# EAGLE schematic switch-QPC1022_v2 (EAGLE 9.5.1)
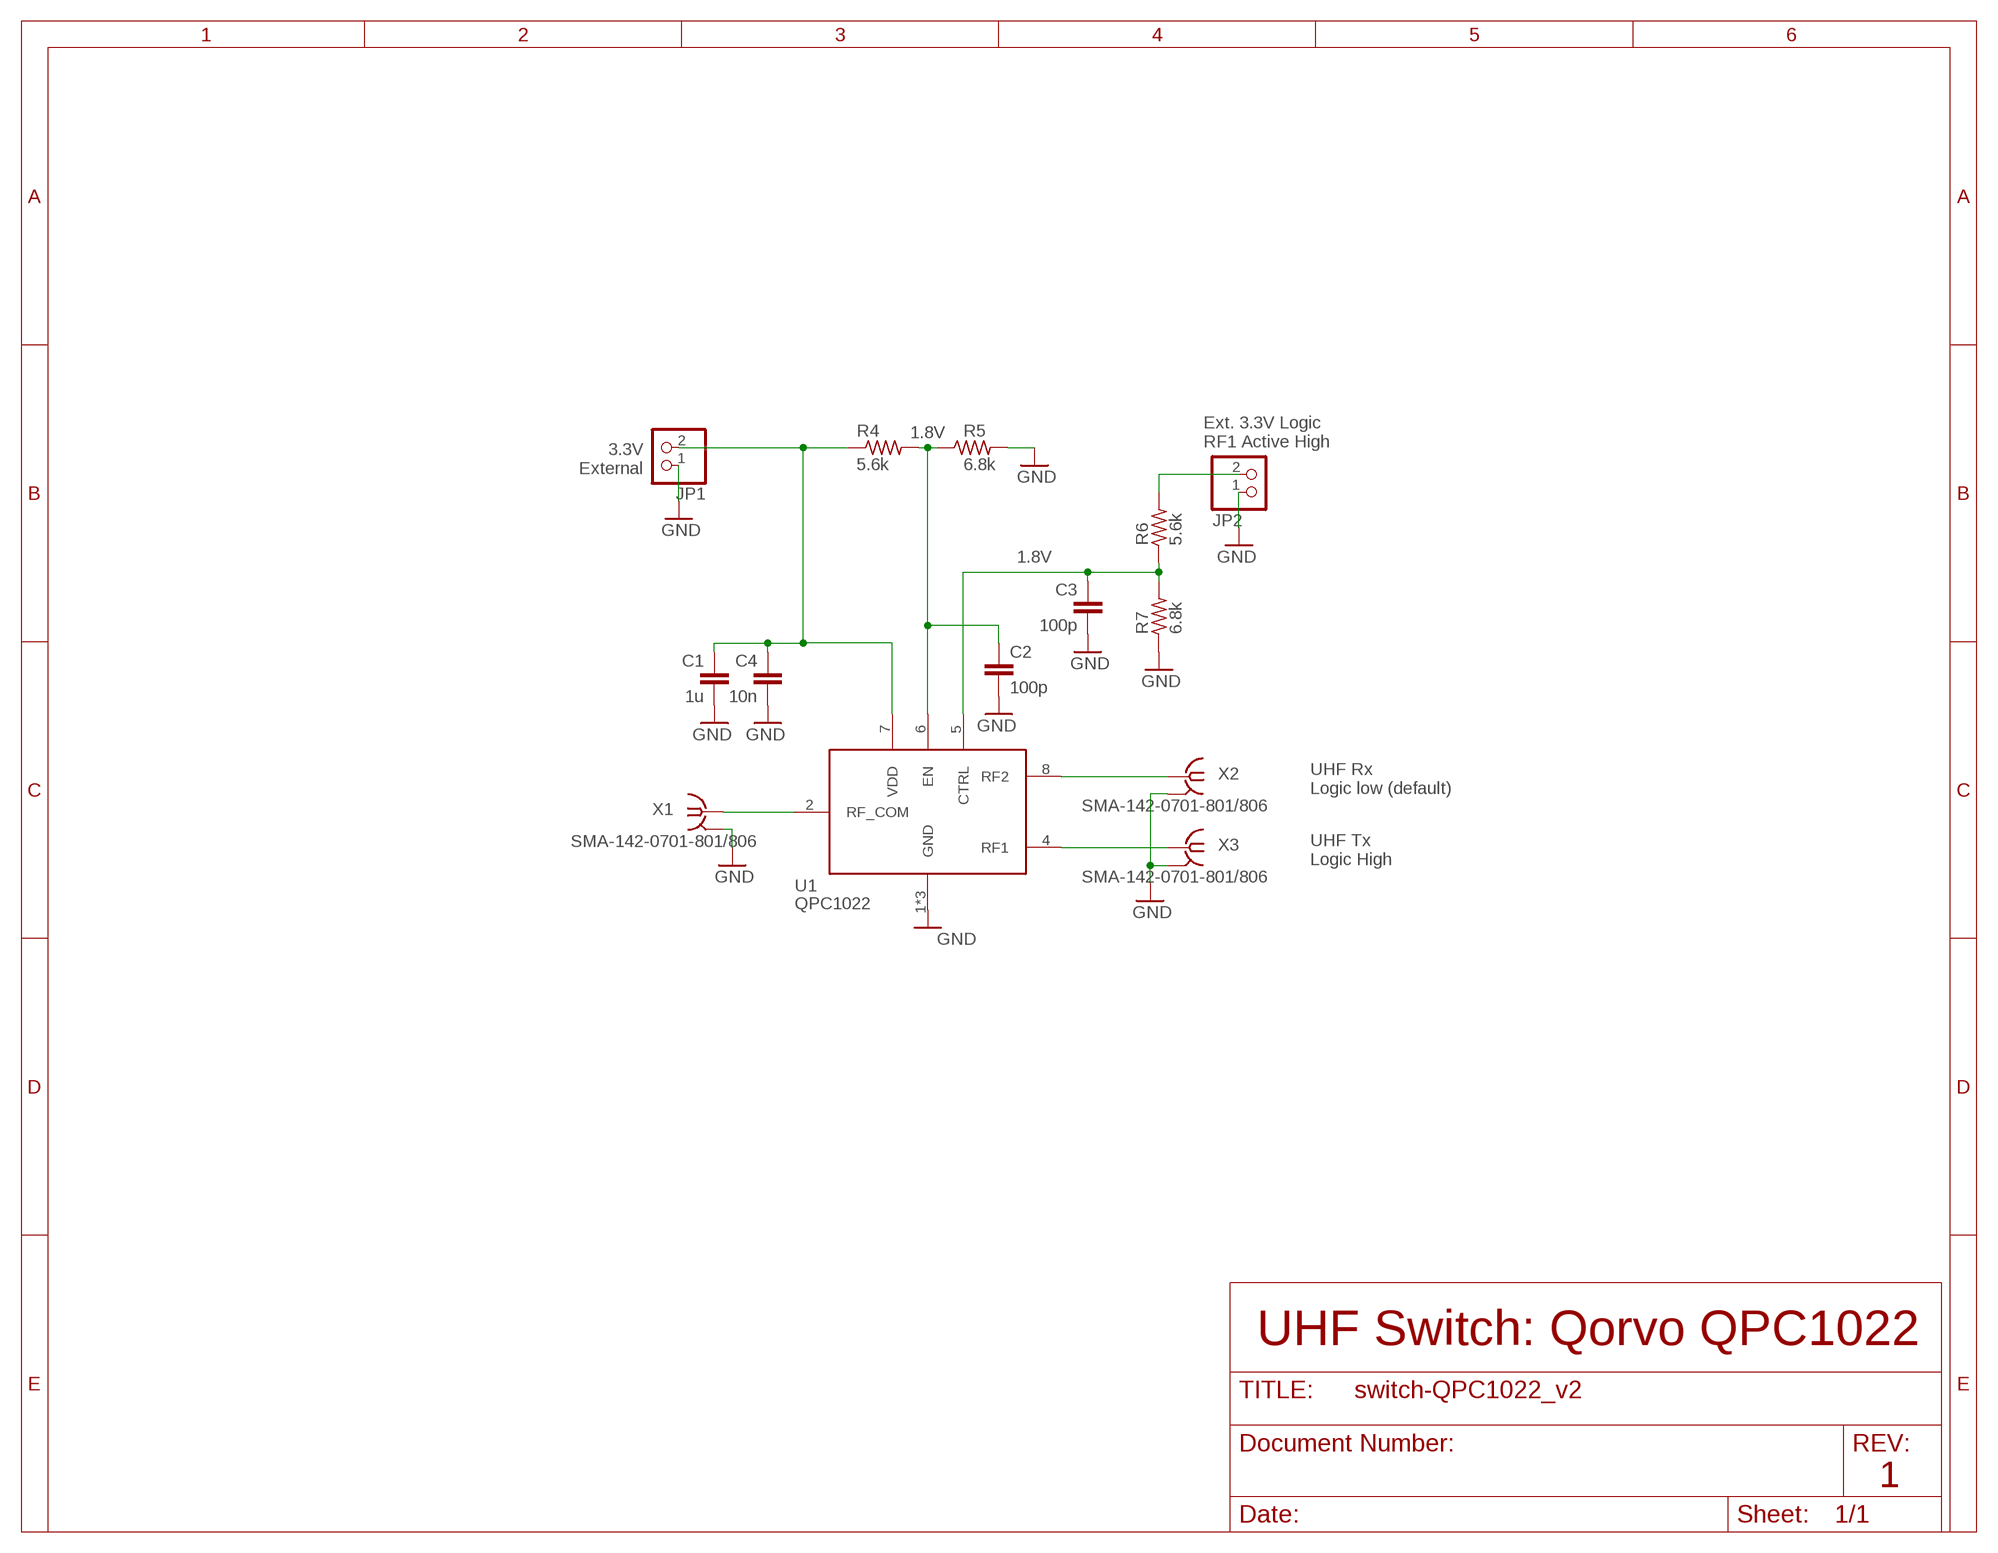
[diagram p0: schematic, sheet 1]

## Parts
C1  1u  C-EU0603-B-NOSILK  [.0603-B-NOSILK]
C2  100p  C-EU0402-B-NOSILK  [.0402-B-NOSILK]
C3  100p  C-EU0402-B-NOSILK  [.0402-B-NOSILK]
C4  10n  C-EU0603-B-NOSILK  [.0603-B-NOSILK]
JP1  PINHD-1X2  [1X02]
JP2  PINHD-1X2  [1X02]
R4  5.6k  R-US_0402-B-NOSILK  [.0402-B-NOSILK]
R5  6.8k  R-US_0402-B-NOSILK  [.0402-B-NOSILK]
R6  5.6k  R-US_0402-B-NOSILK  [.0402-B-NOSILK]
R7  6.8k  R-US_0402-B-NOSILK  [.0402-B-NOSILK]
U1  QPC1022  [QPC1022]
X1  SMA-142-0701-801/806  [J502-ND-142-0701-801/806]
X2  SMA-142-0701-801/806  [J502-ND-142-0701-801/806]
X3  SMA-142-0701-801/806  [J502-ND-142-0701-801/806]

## Nets
GND: C1.2 C2.2 C3.2 C4.2 JP1.1 JP2.1 R5.2 R7.1 U1.1(GND) U1.3(GND) U1.9(GND) X1.G@1 X1.G@2 X1.G@3 X1.G@4 X2.G@1 X2.G@2 X2.G@3 X2.G@4 X3.G@1 X3.G@2 X3.G@3 X3.G@4
N$1: C3.1 R6.1 R7.2 U1.5(CTRL)
N$2: C1.1 C4.1 JP1.2 R4.1 U1.7(VDD)
N$4: JP2.2 R6.2
N$5: C2.1 R4.2 R5.1 U1.6(EN)
N$58: U1.2(RF_COM) X1.1
N$59: U1.8(RF2) X2.1
N$60: U1.4(RF1) X3.1

## Notes on the sheet
- 1.8V
- Ext. 3.3V Logic
  RF1 Active High
- 3.3V
  External
- 1.8V
- UHF Rx
  Logic low (default)
- UHF Tx
  Logic High
- UHF Switch: Qorvo QPC1022
- 1

## Library data of the parts
C1-C4 = oresat-rcl:C-EU: CAPACITOR, European symbol
JP1 JP2 = pinhead:PINHD-1X2: PIN HEADER
R4-R7 = oresat-rcl:R-US_: RESISTOR, American symbol
U1 = U-Qorvo-QPC1022-RF-SPDT-switch:QPC1022; MFR: Qorvo; MPN: QPC1022
X1-X3 = con-coax:SMA-: SMA 50 Ohm End Launch Jack Receptacle - Round Contact Johnson Components Source: www.johnsoncomponents.com .. J502-ND.pdf; MF: JOHNSON COMPONENTS; MPN: 142-0701-801; OC_FARNELL: 1608592; OC_NEWARK: 90F2624